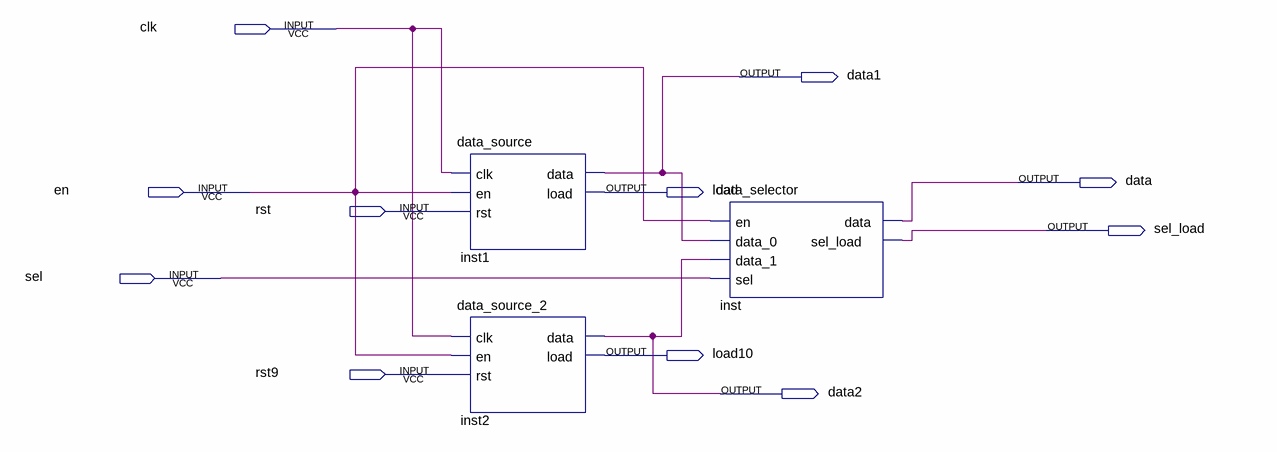
[diagram p0: schematic sheet]
// Quartus schematic Block2.bdf as structural Verilog: 3 symbols, 11 pins
module Block2 (
  input  clk,
  input  en,
  input  rst,
  input  sel,
  input  rst9,
  output data1,
  output data,
  output load,
  output sel_load,
  output load10,
  output data2
);

  data_source inst1 (.clk(clk), .en(en), .rst(rst), .data(data1), .load(load));
  data_source_2 inst2 (.clk(clk), .en(en), .rst(rst9), .data(data2), .load(load10));
  data_selector inst (.en(en), .data_0(data1), .data_1(data2), .sel(sel), .data(data), .sel_load(sel_load));
endmodule
